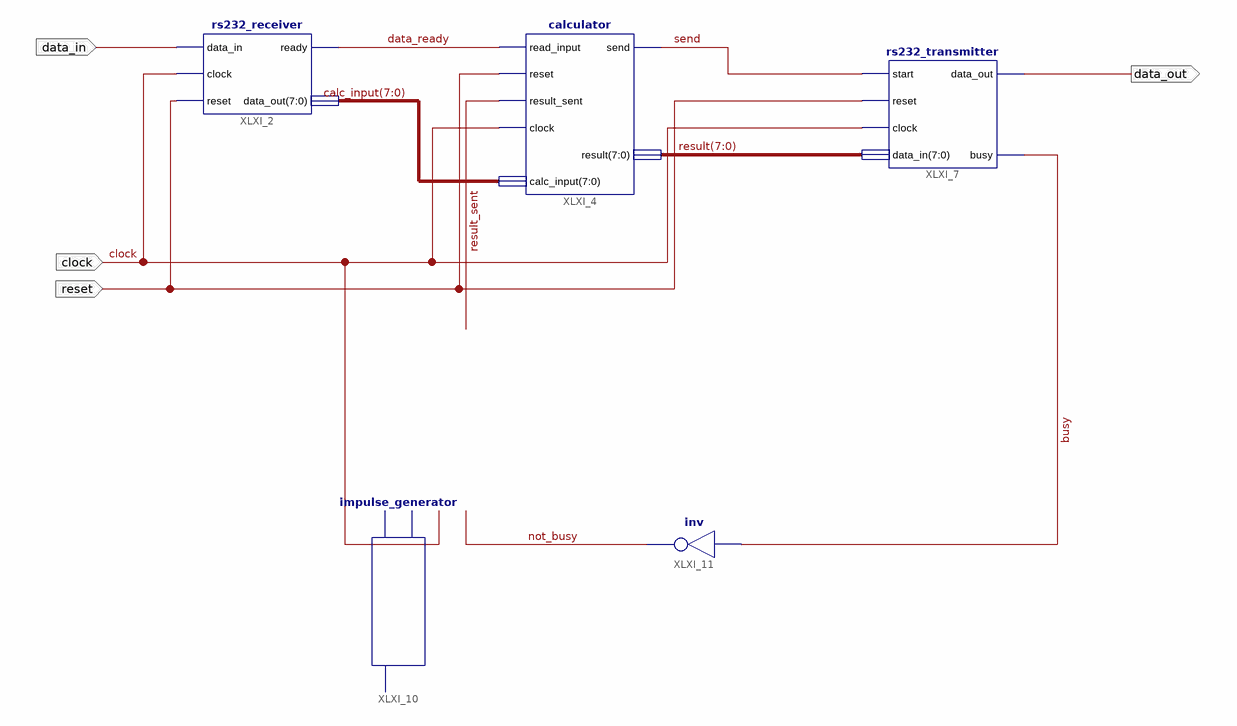
[diagram p0: schematic sheet 1]
// Xilinx ISE schematic calculator_implementacja.sch (spartan3e) as structural Verilog: 5 symbols, 4 ports
module calculator_implementacja (
  input  reset,
  input  data_in,
  input  clock,
  output data_out
);

  wire busy, data_ready, not_busy, result_sent, send;
  wire [7:0] calc_input, result;

  rs232_receiver XLXI_2 (.data_in(data_in), .clock(clock), .reset(reset), .ready(data_ready), .data_out(calc_input));
  calculator XLXI_4 (
    .read_input(data_ready), .reset(reset), .result_sent(result_sent), .clock(clock),
    .calc_input(calc_input), .send(send), .result(result));
  rs232_transmitter XLXI_7 (
    .start(send), .reset(reset), .clock(clock), .data_in(result), .data_out(data_out), .busy(busy));
  impulse_generator XLXI_10 (.input_signal(not_busy), .clock(clock), .output_impulse(result_sent));
  not XLXI_11 (not_busy, busy);
endmodule
